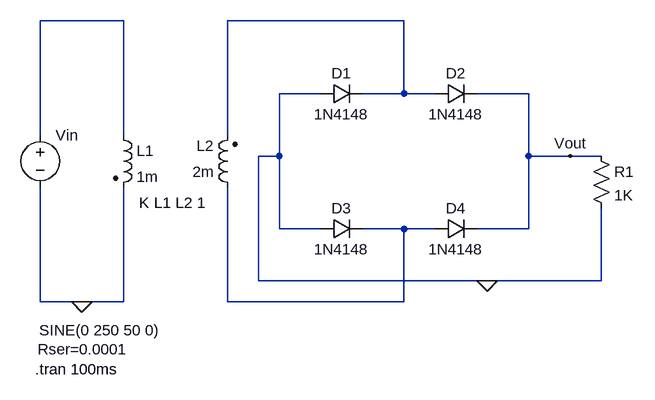
[diagram p0: schematic Exp 3 (Full-wave).asc]
Exp 3 (Full-wave).asc, the LTspice schematic file:
Version 4
SHEET 1 880 680
WIRE -240 -528 -368 -528
WIRE 192 -528 -80 -528
WIRE 64 -416 0 -416
WIRE 192 -416 192 -528
WIRE 192 -416 128 -416
WIRE 240 -416 192 -416
WIRE 384 -416 304 -416
WIRE -368 -352 -368 -528
WIRE -240 -352 -240 -528
WIRE -80 -352 -80 -528
WIRE 0 -320 0 -416
WIRE 0 -320 -32 -320
WIRE 384 -320 384 -416
WIRE 448 -320 384 -320
WIRE 496 -320 448 -320
WIRE 0 -208 0 -320
WIRE 64 -208 0 -208
WIRE 192 -208 128 -208
WIRE 240 -208 192 -208
WIRE 384 -208 384 -320
WIRE 384 -208 304 -208
WIRE -32 -128 -32 -320
WIRE 320 -128 -32 -128
WIRE 496 -128 496 -240
WIRE 496 -128 320 -128
WIRE -368 -96 -368 -272
WIRE -304 -96 -368 -96
WIRE -240 -96 -240 -272
WIRE -240 -96 -304 -96
WIRE -80 -96 -80 -272
WIRE 192 -96 192 -208
WIRE 192 -96 -80 -96
FLAG 320 -128 0
FLAG -304 -96 0
FLAG 448 -320 Vout
SYMBOL diode 64 -400 R270
WINDOW 0 32 32 VTop 2
WINDOW 3 0 32 VBottom 2
SYMATTR InstName D1
SYMATTR Value 1N4148
SYMBOL diode 240 -400 R270
WINDOW 0 32 32 VTop 2
WINDOW 3 0 32 VBottom 2
SYMATTR InstName D2
SYMATTR Value 1N4148
SYMBOL diode 64 -192 R270
WINDOW 0 32 32 VTop 2
WINDOW 3 0 32 VBottom 2
SYMATTR InstName D3
SYMATTR Value 1N4148
SYMBOL diode 240 -192 R270
WINDOW 0 32 32 VTop 2
WINDOW 3 0 32 VBottom 2
SYMATTR InstName D4
SYMATTR Value 1N4148
SYMBOL ind2 -256 -368 R0
SYMATTR InstName L1
SYMATTR Value 1m
SYMATTR Type ind
SYMBOL ind2 -64 -256 R180
WINDOW 0 36 80 Left 2
WINDOW 3 36 40 Left 2
SYMATTR InstName L2
SYMATTR Value 2m
SYMATTR Type ind
SYMBOL voltage -368 -368 R0
WINDOW 3 -2 316 Left 2
WINDOW 123 0 0 Left 0
WINDOW 39 -4 345 Left 2
SYMATTR Value SINE(0 250 50 0)
SYMATTR SpiceLine Rser=0.0001
SYMATTR InstName Vin
SYMBOL res 480 -336 R0
SYMATTR InstName R1
SYMATTR Value 1K
TEXT -216 -248 Left 2 !K L1 L2 1
TEXT -376 8 Left 2 !.tran 100ms

The netlist it stands for:
* Exp 3 (Full-wave).asc
D1 0 N002 1N4148
D2 N002 Vout 1N4148
D3 0 N003 1N4148
D4 N003 Vout 1N4148
L1 N001 0 1m
L2 N003 N002 2m
Vin N001 0 SINE(0 250 50 0) Rser=0.0001
R1 Vout 0 1K
.model D D
.lib standard.dio
K L1 L2 1
.tran 100ms
.backanno
.end